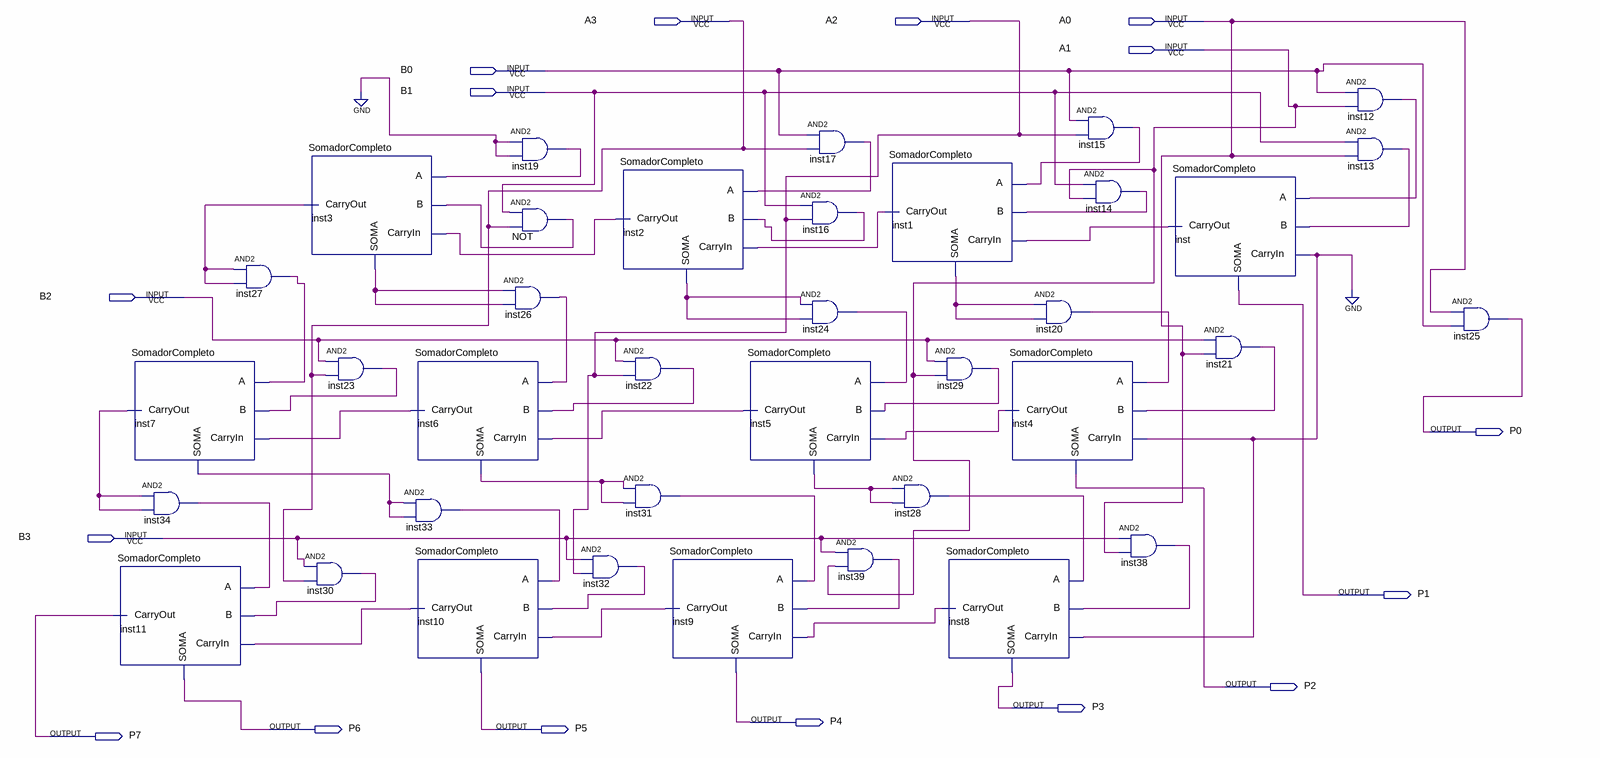
[diagram p0: schematic sheet]
// Quartus schematic Multiplicador.bdf as structural Verilog: 37 symbols, 16 pins
module Multiplicador (
  input  A3,
  input  A2,
  input  A0,
  input  A1,
  input  B0,
  input  B1,
  input  B2,
  input  B3,
  output P0,
  output P1,
  output P2,
  output P3,
  output P4,
  output P6,
  output P5,
  output P7
);

  wire inst1_carryout, inst1_soma, inst2_carryout, inst2_soma, inst3_carryout, inst3_soma, inst4_carryout,
       inst5_carryout, inst5_soma, inst6_carryout, inst6_soma, inst7_carryout, inst7_soma, inst8_carryout,
       inst9_carryout, inst10_carryout, inst12_out, inst13_out, inst14_out, inst15_out, inst16_out,
       inst17_out, inst19_out, inst20_out, inst21_out, inst22_out, inst23_out, inst24_out, inst26_out,
       inst27_out, inst28_out, inst29_out, inst30_out, inst31_out, inst32_out, inst33_out, inst34_out,
       inst38_out, inst39_out, inst_carryout, NOT_out;

  SomadorCompleto inst11 (.A(inst34_out), .B(inst30_out), .CarryIn(inst10_carryout), .CarryOut(P7), .SOMA(P6));
  SomadorCompleto inst7 (
    .A(inst27_out), .B(inst23_out), .CarryIn(inst6_carryout), .CarryOut(inst7_carryout), .SOMA(inst7_soma));
  and inst34 (inst34_out, inst7_carryout, inst7_carryout);
  and inst27 (inst27_out, inst3_carryout, inst3_carryout);
  SomadorCompleto inst3 (
    .A(inst19_out), .B(NOT_out), .CarryIn(inst2_carryout), .CarryOut(inst3_carryout), .SOMA(inst3_soma));
  and inst23 (inst23_out, B2, A3);
  and inst30 (inst30_out, B3, A3);
  SomadorCompleto inst6 (
    .A(inst26_out), .B(inst22_out), .CarryIn(inst5_carryout), .CarryOut(inst6_carryout), .SOMA(inst6_soma));
  and inst33 (inst33_out, inst7_soma, inst7_soma);
  SomadorCompleto inst10 (
    .A(inst33_out), .B(inst32_out), .CarryIn(inst9_carryout), .CarryOut(inst10_carryout), .SOMA(P5));
  and inst19 (inst19_out, 1'b0, 1'b0);
  and NOT (NOT_out, B1, A3);
  and inst26 (inst26_out, inst3_soma, inst3_soma);
  SomadorCompleto inst2 (
    .A(inst17_out), .B(inst16_out), .CarryIn(inst1_carryout), .CarryOut(inst2_carryout), .SOMA(inst2_soma));
  and inst22 (inst22_out, B2, A2);
  and inst31 (inst31_out, inst6_soma, inst6_soma);
  and inst32 (inst32_out, B3, A2);
  SomadorCompleto inst9 (
    .A(inst31_out), .B(inst39_out), .CarryIn(inst8_carryout), .CarryOut(inst9_carryout), .SOMA(P4));
  SomadorCompleto inst5 (
    .A(inst24_out), .B(inst29_out), .CarryIn(inst4_carryout), .CarryOut(inst5_carryout), .SOMA(inst5_soma));
  and inst17 (inst17_out, B0, A3);
  and inst16 (inst16_out, B1, A2);
  and inst24 (inst24_out, inst2_soma, inst2_soma);
  and inst39 (inst39_out, B3, A1);
  SomadorCompleto inst1 (
    .A(inst15_out), .B(inst14_out), .CarryIn(inst_carryout), .CarryOut(inst1_carryout), .SOMA(inst1_soma));
  and inst28 (inst28_out, inst5_soma, inst5_soma);
  and inst29 (inst29_out, B2, A1);
  SomadorCompleto inst8 (.A(inst28_out), .B(inst38_out), .CarryIn(1'b0), .CarryOut(inst8_carryout), .SOMA(P3));
  SomadorCompleto inst4 (.A(inst20_out), .B(inst21_out), .CarryIn(1'b0), .CarryOut(inst4_carryout), .SOMA(P2));
  and inst15 (inst15_out, B0, A2);
  and inst20 (inst20_out, inst1_soma, inst1_soma);
  and inst14 (inst14_out, B1, A1);
  and inst38 (inst38_out, B3, A0);
  SomadorCompleto inst (.A(inst12_out), .B(inst13_out), .CarryIn(1'b0), .CarryOut(inst_carryout), .SOMA(P1));
  and inst21 (inst21_out, B2, A0);
  and inst12 (inst12_out, B0, A1);
  and inst13 (inst13_out, B1, A0);
  and inst25 (P0, A0, B0);
endmodule
